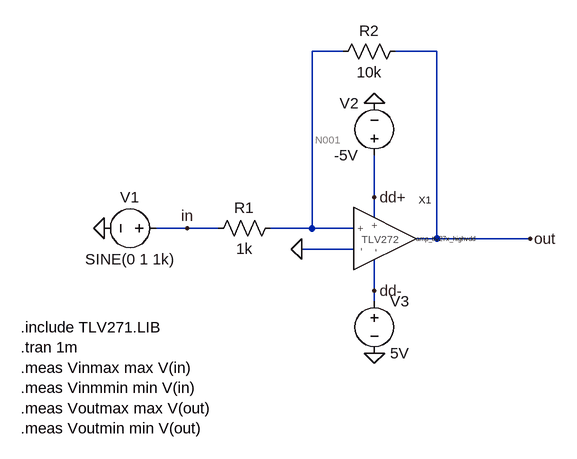
[diagram p0: schematic Exercise6.asc]
Exercise6.asc, the LTspice schematic file:
Version 4.1
SHEET 1 880 680
WIRE 112 -160 64 -160
WIRE 256 -160 192 -160
WIRE 160 64 160 0
WIRE 160 96 160 64
WIRE -128 112 -176 112
WIRE -80 112 -128 112
WIRE 64 112 64 -160
WIRE 64 112 0 112
WIRE 128 112 64 112
WIRE 256 128 256 -160
WIRE 256 128 224 128
WIRE 400 128 256 128
WIRE 128 144 48 144
WIRE 160 208 160 160
WIRE 160 224 160 208
FLAG -256 112 0
FLAG 48 144 0
FLAG -128 112 in
FLAG 400 128 out
FLAG 160 -80 0
FLAG 160 304 0
FLAG 160 64 dd+
FLAG 160 208 dd-
SYMBOL EEL3111C\\amp_tlv27x_highVdd 224 128 R0
WINDOW 3 0 0 Left 0
SYMATTR Value amp_tlv27x_highvdd
SYMATTR InstName X1
SYMATTR Prefix X
SYMBOL res 16 96 R90
WINDOW 0 0 56 VBottom 2
WINDOW 3 32 56 VTop 2
SYMATTR InstName R1
SYMATTR Value 1k
SYMBOL voltage -160 112 R90
WINDOW 0 -32 56 VBottom 2
WINDOW 3 32 56 VTop 2
WINDOW 123 0 0 Left 0
WINDOW 39 0 0 Left 0
SYMATTR InstName V1
SYMATTR Value SINE(0 1 1k)
SYMBOL res 208 -176 R90
WINDOW 0 0 56 VBottom 2
WINDOW 3 32 56 VTop 2
SYMATTR InstName R2
SYMATTR Value 10k
SYMBOL voltage 160 16 R180
WINDOW 0 24 96 Left 2
WINDOW 3 24 16 Left 2
WINDOW 123 0 0 Left 0
WINDOW 39 0 0 Left 0
SYMATTR InstName V2
SYMATTR Value -5V
SYMBOL voltage 160 208 R0
WINDOW 123 0 0 Left 0
WINDOW 39 0 0 Left 0
SYMATTR InstName V3
SYMATTR Value 5V
TEXT -384 264 Left 2 !.include TLV271.LIB\n.tran 1m\n.meas Vinmax max V(in)\n.meas Vinmmin min V(in)\n.meas Voutmax max V(out)\n.meas Voutmin min V(out)

The netlist it stands for:
* Exercise6.asc
X§X1 0 N001 dd+ dd- out amp_tlv27x_highVdd params: amp_tlv27x_highvdd  ; pins 1 2 3 4 5
R1 N001 in 1k
V1 in 0 SINE(0 1 1k)
R2 out N001 10k
V2 dd+ 0 -5V
V3 dd- 0 5V
.include TLV271.LIB
.tran 1m
.meas Vinmax max V(in)
.meas Vinmmin min V(in)
.meas Voutmax max V(out)
.meas Voutmin min V(out)
.backanno
.end

* Results of the author's LTspice run, read from the files saved beside the schematic
* Operating Point, zero values left out:
*   V(dd+) = -5 V
*   V(dd-) = 5 V
*   V(n001) = -45.03 mV
*   V(out) = -7.404 µV
*   I(R1) = -45.03 µA
*   I(R2) = 4.503 µA
*   I(V1) = -45.03 µA
*   I(V2) = 8.507 TA
*   I(V3) = -8.507 TA
*   Ix(x1:1) = 98.23 µA
*   Ix(x1:2) = 49.54 µA
*   Ix(x1:3) = -8.507 TA
*   Ix(x1:4) = 8.507 TA
*   Ix(x1:5) = -4.503 µA
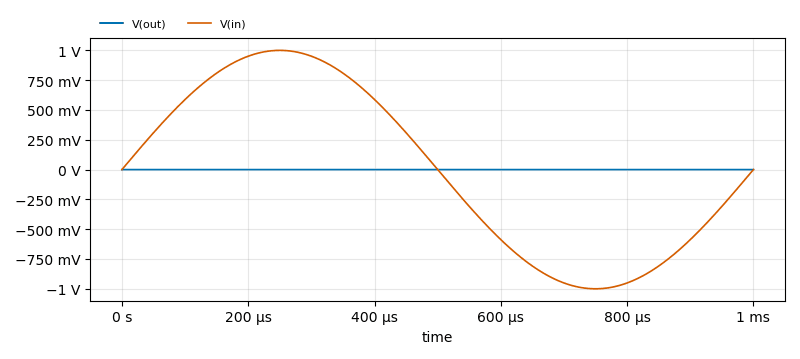
[diagram p1: Transient Analysis of Exercise6.asc, plotted from the saved traces]
* Transient Analysis, 1 run:
*   V(out): min -7.475 µV, max 7.467 µV, average -352.7 nV, rms 7.411 µV, last -7.405 µV
*   V(in): min -1 V, max 1 V, average 0 V, rms 707.1 mV, last 0 V
* From the log:
*   vinmax: MAX(V(in))=0.999996423721 FROM 0 TO 0.001
*   vinmmin: MIN(V(in))=-0.999995470047 FROM 0 TO 0.001
*   voutmax: MAX(V(out))=7.46687737774e-06 FROM 0 TO 0.001
*   voutmin: MIN(V(out))=-7.47503099774e-06 FROM 0 TO 0.001